# Altium schematic sheet Isolation Unit.SchDoc
size A4
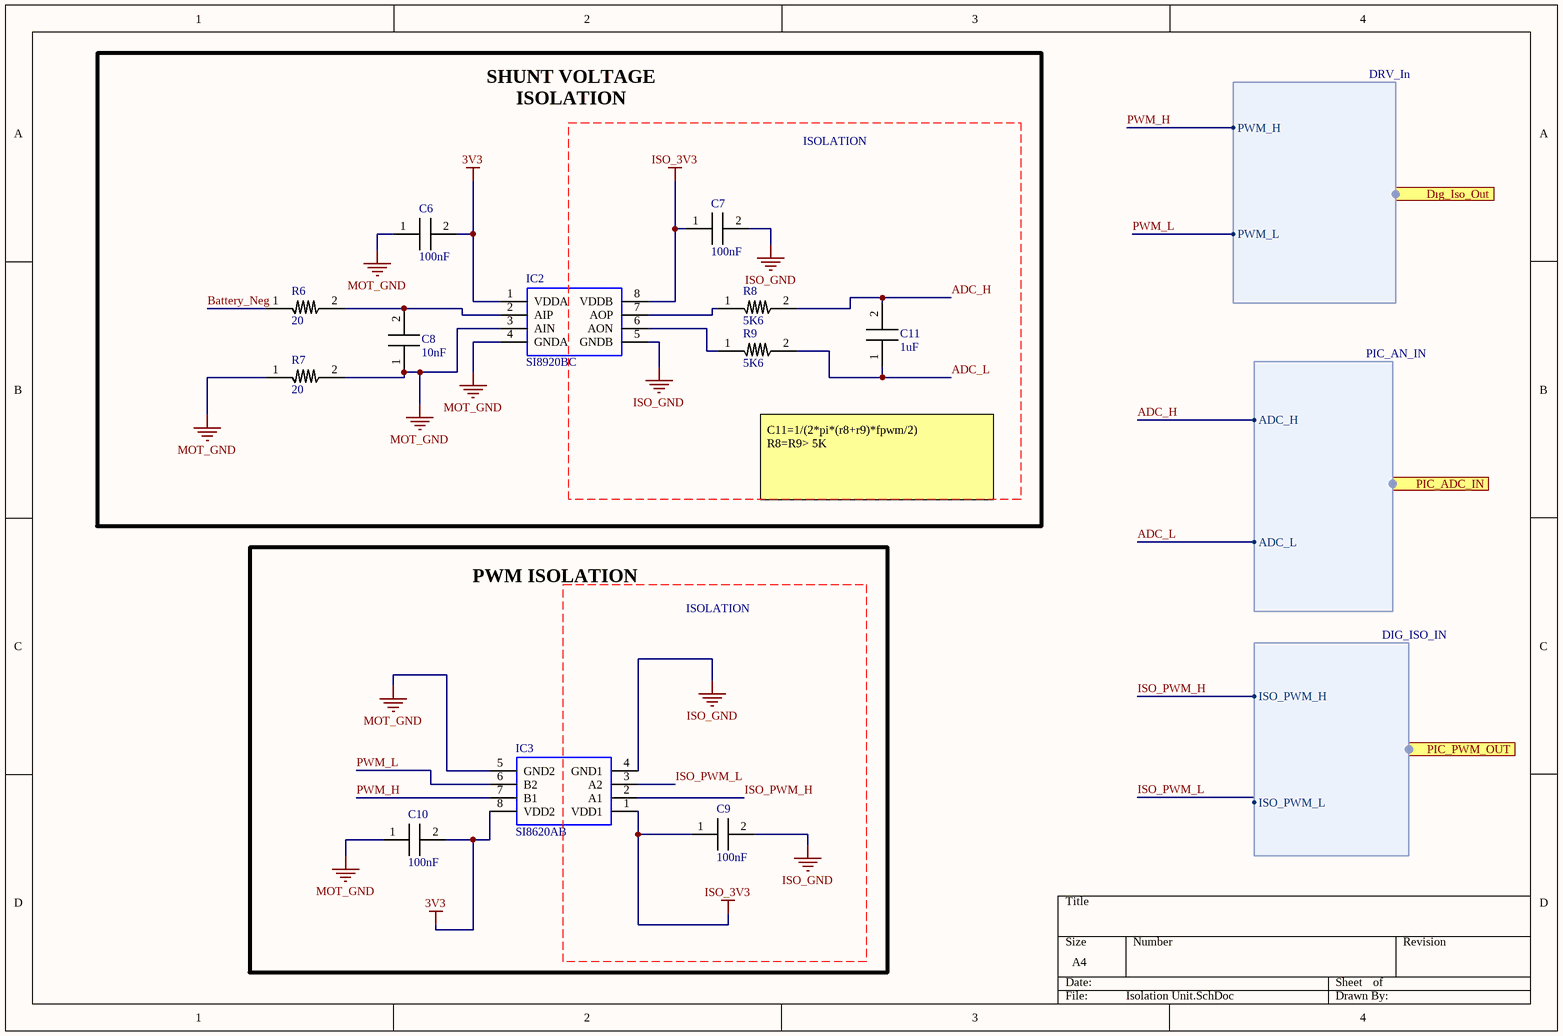
[diagram p0: Isolation Unit.SchDoc]

## Parts
C6  Parameter 1: 100nF  (hidden comment: CAP 100nF)
C7  Parameter 1: 100nF  (hidden comment: CAP 100nF)
C8  Parameter 1: 10nF  (hidden comment: CAP 10nF)
C9  Parameter 1: 100nF  (hidden comment: CAP 100nF)
C10  Parameter 1: 100nF  (hidden comment: CAP 100nF)
C11  Parameter 1: 1uF  (hidden comment: CAP 1uF)
IC2  SI8920BC  [SI8920BC-IP]
IC3  SI8620AB  [SI8620AB]
R6  Parameter 1: 20  (hidden comment: RES, 20, 0603)
R7  Parameter 1: 20  (hidden comment: RES, 20, 0603)
R8  Parameter 1: 5K6  (hidden comment: RES, 5K6, 0603)
R9  Parameter 1: 5K6  (hidden comment: RES, 5K6, 0603)

## Blocks framed on the sheet
ISOLATION: C6-C8 C11 IC2 R6-R9
ISOLATION: C9 C10 IC3

## Ports
Dıg_Iso_Out (harness DRV_In), PIC_ADC_IN (harness PIC_AN_IN), PIC_PWM_OUT (harness DIG_ISO_IN)

## Harnesses
DRV_In: PWM_H, PWM_L
PIC_AN_IN: ADC_H, ADC_L
DIG_ISO_IN: ISO_PWM_H, ISO_PWM_L

## Nets
3V3: C6.2 C10.2 IC2.1(VDDA) IC3.8(VDD2)
ISO_3V3: C7.1 C9.1 IC2.8(VDDB) IC3.1(VDD1)
ISO_GND: C7.2 C9.2 IC2.5(GNDB) IC3.4(GND1)
MOT_GND: C6.1 C8.1 C10.1 IC2.3(AIN) IC2.4(GNDA) IC3.5(GND2) R7.1 R7.2
ADC_H: C11.2 R8.2 ; port PIC_ADC_IN.ADC_H
ADC_L: C11.1 R9.2 ; port PIC_ADC_IN.ADC_L
Battery_Neg: R6.1
ISO_PWM_H: IC3.2(A1) ; port PIC_PWM_OUT.ISO_PWM_H
ISO_PWM_L: IC3.3(A2) ; port PIC_PWM_OUT.ISO_PWM_L
PWM_H: IC3.7(B1) ; port Dıg_Iso_Out.PWM_H
PWM_L: IC3.6(B2) ; port Dıg_Iso_Out.PWM_L
NetC8_2: C8.2 IC2.2(AIP) R6.2
NetIC2_6: IC2.6(AON) R9.1
NetIC2_7: IC2.7(AOP) R8.1

## Notes on the sheet
- SHUNT VOLTAGE ISOLATION
- C11=1/(2*pi*(r8+r9)*fpwm/2)
  R8=R9> 5K
- PWM ISOLATION

## Library data of the parts
IC2 = IC ISO OP-AMP,SI8920BC
IC3 = IC ISO DIG, SI8620AB